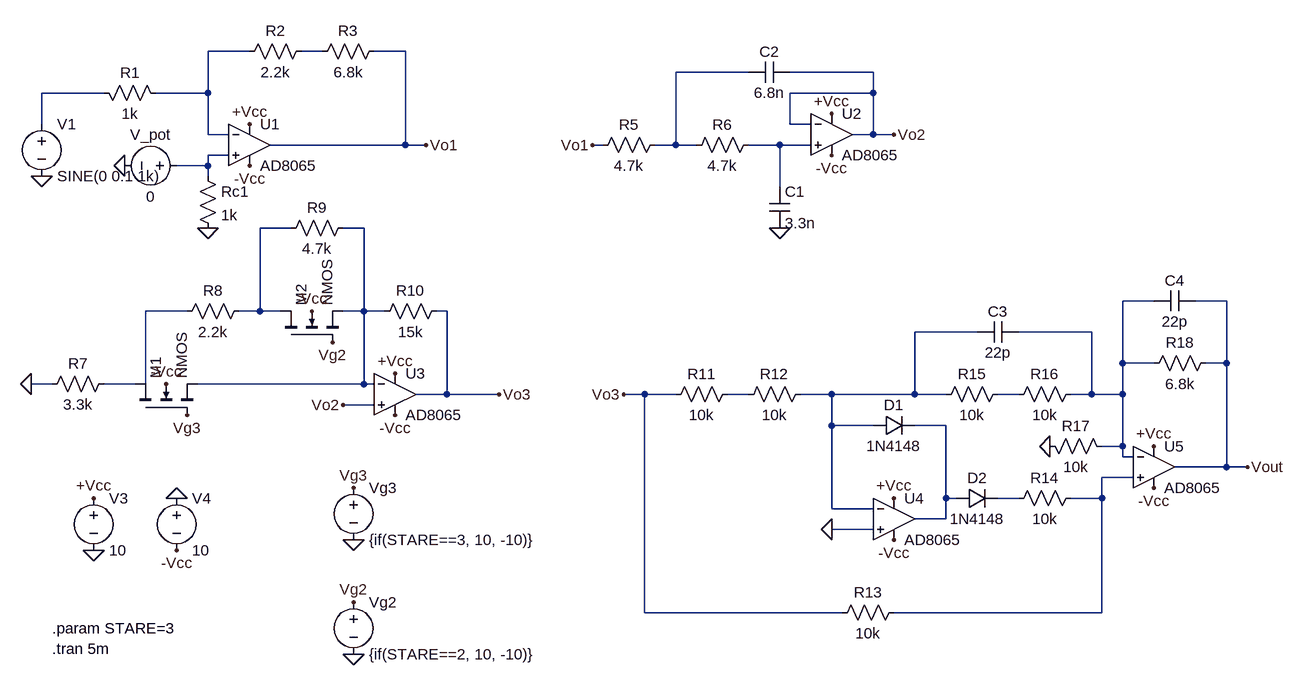
[diagram p0: schematic CircuitFull.asc]
CircuitFull.asc, the LTspice schematic file:
Version 4.1
SHEET 1 1816 816
WIRE 208 -144 144 -144
WIRE 320 -144 288 -144
WIRE 448 -144 400 -144
WIRE 976 -112 864 -112
WIRE 1168 -112 1040 -112
WIRE -16 -80 -112 -80
WIRE 144 -80 144 -144
WIRE 144 -80 64 -80
WIRE 1168 -80 1168 -112
WIRE 1168 -80 1040 -80
WIRE -112 -32 -112 -80
WIRE 1040 -32 1040 -80
WIRE 1072 -32 1040 -32
WIRE 144 -16 144 -80
WIRE 176 -16 144 -16
WIRE 1168 -16 1168 -80
WIRE 1168 -16 1136 -16
WIRE 1200 -16 1168 -16
WIRE 448 0 448 -144
WIRE 448 0 240 0
WIRE 480 0 448 0
WIRE 752 0 736 0
WIRE 864 0 864 -112
WIRE 864 0 832 0
WIRE 896 0 864 0
WIRE 1024 0 976 0
WIRE 1072 0 1024 0
WIRE 176 16 144 16
WIRE 144 32 144 16
WIRE 144 32 96 32
WIRE 144 48 144 32
WIRE 1024 64 1024 0
WIRE 272 128 224 128
WIRE 384 128 352 128
WIRE 1600 240 1552 240
WIRE 1712 240 1664 240
WIRE 112 256 48 256
WIRE 224 256 224 128
WIRE 224 256 192 256
WIRE 256 256 224 256
WIRE 384 256 384 128
WIRE 384 256 352 256
WIRE 416 256 384 256
WIRE 512 256 496 256
WIRE 1328 288 1232 288
WIRE 1504 288 1392 288
WIRE 1552 336 1552 240
WIRE 1600 336 1552 336
WIRE 1712 336 1712 240
WIRE 1712 336 1680 336
WIRE -96 368 -128 368
WIRE 32 368 -16 368
WIRE 48 368 48 256
WIRE 384 368 384 256
WIRE 384 368 128 368
WIRE 400 368 384 368
WIRE 512 384 512 256
WIRE 512 384 464 384
WIRE 592 384 512 384
WIRE 816 384 784 384
WIRE 864 384 816 384
WIRE 976 384 944 384
WIRE 1104 384 1056 384
WIRE 1232 384 1232 288
WIRE 1232 384 1104 384
WIRE 1280 384 1232 384
WIRE 1392 384 1360 384
WIRE 1504 384 1504 288
WIRE 1504 384 1472 384
WIRE 1552 384 1552 336
WIRE 1552 384 1504 384
WIRE 400 400 352 400
WIRE 1104 432 1104 384
WIRE 1168 432 1104 432
WIRE 1280 432 1232 432
WIRE 1552 464 1552 384
WIRE 1552 464 1520 464
WIRE 1552 480 1552 464
WIRE 1568 480 1552 480
WIRE 1712 496 1712 336
WIRE 1712 496 1632 496
WIRE 1744 496 1712 496
WIRE 1568 512 1520 512
WIRE 1280 544 1280 432
WIRE 1296 544 1280 544
WIRE 1392 544 1360 544
WIRE 1520 544 1520 512
WIRE 1520 544 1472 544
WIRE 1104 560 1104 432
WIRE 1168 560 1104 560
WIRE 1280 576 1280 544
WIRE 1280 576 1232 576
WIRE 1168 592 1104 592
WIRE 816 720 816 384
WIRE 1120 720 816 720
WIRE 1520 720 1520 544
WIRE 1520 720 1200 720
FLAG 16 32 0
FLAG 144 128 0
FLAG -112 48 0
FLAG 480 0 Vo1
FLAG 736 0 Vo1
FLAG 1024 128 0
FLAG 1200 -16 Vo2
FLAG -128 368 0
FLAG 352 400 Vo2
FLAG 592 384 Vo3
FLAG 784 384 Vo3
FLAG 1104 592 0
FLAG 1440 464 0
FLAG 1744 496 Vout
FLAG -32 544 +Vcc
FLAG 208 -32 +Vcc
FLAG 1104 -48 +Vcc
FLAG 432 352 +Vcc
FLAG 1200 544 +Vcc
FLAG 1600 464 +Vcc
FLAG 96 624 -Vcc
FLAG 432 416 -Vcc
FLAG 208 32 -Vcc
FLAG 1104 16 -Vcc
FLAG 1200 608 -Vcc
FLAG 1600 528 -Vcc
FLAG 304 256 -Vcc
FLAG 80 368 -Vcc
FLAG 368 704 Vg2
FLAG 336 304 Vg2
FLAG 368 528 Vg3
FLAG 112 416 Vg3
FLAG 96 544 0
FLAG -32 624 0
FLAG 368 784 0
FLAG 368 608 0
SYMBOL voltage -112 -48 R0
WINDOW 123 0 0 Left 0
WINDOW 39 0 0 Left 0
SYMATTR InstName V1
SYMATTR Value SINE(0 0.1 1k)
SYMBOL res -32 -96 M90
WINDOW 0 0 56 VBottom 2
WINDOW 3 32 56 VTop 2
SYMATTR InstName R1
SYMATTR Value 1k
SYMBOL res 304 -160 R90
WINDOW 0 0 56 VBottom 2
WINDOW 3 32 56 VTop 2
SYMATTR InstName R2
SYMATTR Value 2.2k
SYMBOL res 416 -160 R90
WINDOW 0 0 56 VBottom 2
WINDOW 3 32 56 VTop 2
SYMATTR InstName R3
SYMATTR Value 6.8k
SYMBOL OpAmps\\AD8065 208 -64 R0
SYMATTR InstName U1
SYMBOL res 128 32 R0
SYMATTR InstName Rc1
SYMATTR Value 1k
SYMBOL voltage 112 32 R90
WINDOW 0 -32 56 VBottom 2
WINDOW 3 32 56 VTop 2
WINDOW 123 0 0 Left 0
WINDOW 39 0 0 Left 0
SYMATTR InstName V_pot
SYMATTR Value 0
SYMBOL res 848 -16 R90
WINDOW 0 0 56 VBottom 2
WINDOW 3 32 56 VTop 2
SYMATTR InstName R5
SYMATTR Value 4.7k
SYMBOL res 992 -16 R90
WINDOW 0 0 56 VBottom 2
WINDOW 3 32 56 VTop 2
SYMATTR InstName R6
SYMATTR Value 4.7k
SYMBOL cap 1008 64 R0
SYMATTR InstName C1
SYMATTR Value 3.3n
SYMBOL OpAmps\\AD8065 1104 -80 R0
SYMATTR InstName U2
SYMBOL cap 1040 -128 R90
WINDOW 0 0 32 VBottom 2
WINDOW 3 32 32 VTop 2
SYMATTR InstName C2
SYMATTR Value 6.8n
SYMBOL res 0 352 R90
WINDOW 0 0 56 VBottom 2
WINDOW 3 32 56 VTop 2
SYMATTR InstName R7
SYMATTR Value 3.3k
SYMBOL nmos4 32 416 R270
SYMATTR InstName M1
SYMBOL res 208 240 R90
WINDOW 0 0 56 VBottom 2
WINDOW 3 32 56 VTop 2
SYMATTR InstName R8
SYMATTR Value 2.2k
SYMBOL res 368 112 R90
WINDOW 0 0 56 VBottom 2
WINDOW 3 32 56 VTop 2
SYMATTR InstName R9
SYMATTR Value 4.7k
SYMBOL nmos4 256 304 R270
SYMATTR InstName M2
SYMBOL res 512 240 R90
WINDOW 0 0 56 VBottom 2
WINDOW 3 32 56 VTop 2
SYMATTR InstName R10
SYMATTR Value 15k
SYMBOL OpAmps\\AD8065 432 320 R0
SYMATTR InstName U3
SYMBOL res 960 368 R90
WINDOW 0 0 56 VBottom 2
WINDOW 3 32 56 VTop 2
SYMATTR InstName R11
SYMATTR Value 10k
SYMBOL res 1072 368 R90
WINDOW 0 0 56 VBottom 2
WINDOW 3 32 56 VTop 2
SYMATTR InstName R12
SYMATTR Value 10k
SYMBOL OpAmps\\AD8065 1200 512 R0
SYMATTR InstName U4
SYMBOL res 1216 704 R90
WINDOW 0 0 56 VBottom 2
WINDOW 3 32 56 VTop 2
SYMATTR InstName R13
SYMATTR Value 10k
SYMBOL diode 1168 448 R270
WINDOW 0 32 32 VTop 2
WINDOW 3 0 32 VBottom 2
SYMATTR InstName D1
SYMATTR Value 1N4148
SYMBOL diode 1296 560 R270
WINDOW 0 32 32 VTop 2
WINDOW 3 0 32 VBottom 2
SYMATTR InstName D2
SYMATTR Value 1N4148
SYMBOL res 1488 528 R90
WINDOW 0 0 56 VBottom 2
WINDOW 3 32 56 VTop 2
SYMATTR InstName R14
SYMATTR Value 10k
SYMBOL res 1376 368 R90
WINDOW 0 0 56 VBottom 2
WINDOW 3 32 56 VTop 2
SYMATTR InstName R15
SYMATTR Value 10k
SYMBOL res 1488 368 R90
WINDOW 0 0 56 VBottom 2
WINDOW 3 32 56 VTop 2
SYMATTR InstName R16
SYMATTR Value 10k
SYMBOL cap 1392 272 R90
WINDOW 0 0 32 VBottom 2
WINDOW 3 32 32 VTop 2
SYMATTR InstName C3
SYMATTR Value 22p
SYMBOL OpAmps\\AD8065 1600 432 R0
SYMATTR InstName U5
SYMBOL res 1424 448 M90
WINDOW 0 0 56 VBottom 2
WINDOW 3 32 56 VTop 2
SYMATTR InstName R17
SYMATTR Value 10k
SYMBOL res 1696 320 R90
WINDOW 0 0 56 VBottom 2
WINDOW 3 32 56 VTop 2
SYMATTR InstName R18
SYMATTR Value 6.8k
SYMBOL cap 1664 224 R90
WINDOW 0 0 32 VBottom 2
WINDOW 3 32 32 VTop 2
SYMATTR InstName C4
SYMATTR Value 22p
SYMBOL voltage -32 528 R0
WINDOW 123 0 0 Left 0
WINDOW 39 0 0 Left 0
SYMATTR InstName V3
SYMATTR Value 10
SYMBOL voltage 96 528 R0
WINDOW 123 0 0 Left 0
WINDOW 39 0 0 Left 0
SYMATTR InstName V4
SYMATTR Value 10
SYMBOL voltage 368 688 R0
WINDOW 123 0 0 Left 0
WINDOW 39 0 0 Left 0
SYMATTR InstName Vg2
SYMATTR Value {if(STARE==2, 10, -10)}
SYMBOL voltage 368 512 R0
WINDOW 123 0 0 Left 0
WINDOW 39 0 0 Left 0
SYMATTR InstName Vg3
SYMATTR Value {if(STARE==3, 10, -10)}
TEXT -96 744 Left 2 !.param STARE=3
TEXT -96 776 Left 2 !.tran 5m

The netlist it stands for:
* CircuitFull.asc
V1 N004 0 SINE(0 0.1 1k)
R1 N004 N001 1k
R2 N002 N001 2.2k
R3 Vo1 N002 6.8k
X§U1 N006 N001 +Vcc -Vcc Vo1 AD8065  ; pins In+ In- V+ V- OUT
Rc1 N006 0 1k
V_pot N006 0 0
R5 N003 Vo1 4.7k
R6 N005 N003 4.7k
C1 N005 0 3.3n
X§U2 N005 Vo2 +Vcc -Vcc Vo2 AD8065  ; pins In+ In- V+ V- OUT
C2 Vo2 N003 6.8n
R7 N012 0 3.3k
M1 N012 Vg3 N008 -Vcc NMOS
R8 N007 N010 2.2k
R9 N008 N007 4.7k
M2 N007 Vg2 N008 -Vcc NMOS
R10 Vo3 N008 15k
X§U3 Vo2 N008 +Vcc -Vcc Vo3 AD8065  ; pins In+ In- V+ V- OUT
R11 N013 Vo3 10k
R12 N011 N013 10k
X§U4 0 N011 +Vcc -Vcc N015 AD8065  ; pins In+ In- V+ V- OUT
R13 N016 Vo3 10k
D1 N011 N015 1N4148
D2 N015 N017 1N4148
R14 N016 N017 10k
R15 N014 N011 10k
R16 N009 N014 10k
C3 N009 N011 22p
X§U5 N016 N009 +Vcc -Vcc Vout AD8065  ; pins In+ In- V+ V- OUT
R17 0 N009 10k
R18 Vout N009 6.8k
C4 Vout N009 22p
V3 +Vcc 0 10
V4 0 -Vcc 10
Vg2 Vg2 0 {if(STARE==2, 10, -10)}
Vg3 Vg3 0 {if(STARE==3, 10, -10)}
.model D D
.lib standard.dio
.model NMOS NMOS
.model PMOS PMOS
.lib standard.mos
.param STARE=3
.tran 5m
.backanno
.end